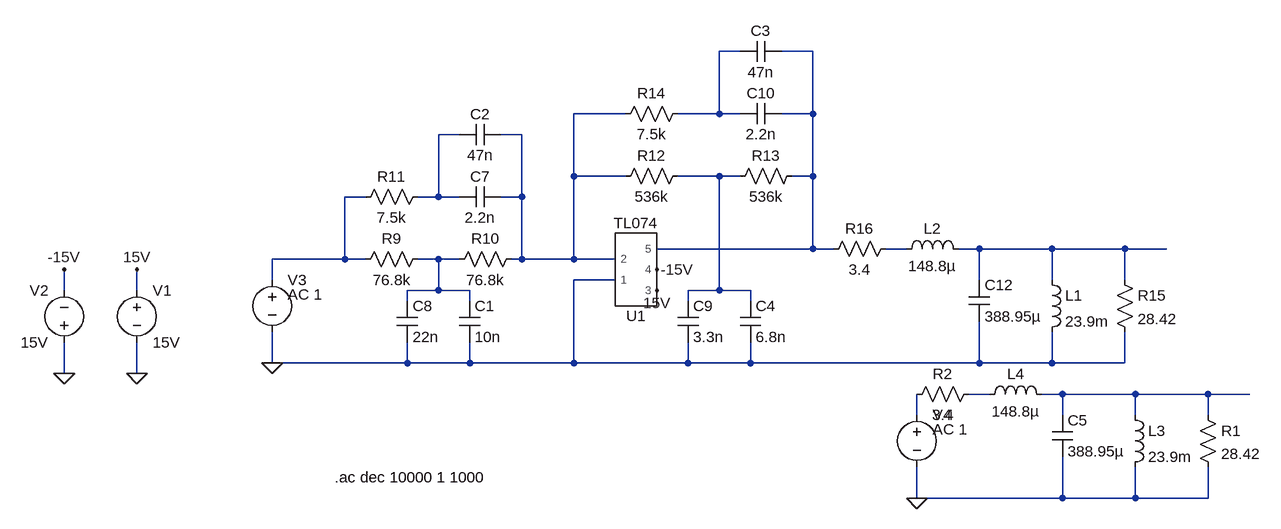
[diagram p0: schematic unmounted_pyle_lt_tl074.asc]
unmounted_pyle_lt_tl074.asc, the LTspice schematic file:
Version 4
SHEET 1 880 996
WIRE -704 240 -736 240
WIRE -592 240 -640 240
WIRE -880 336 -960 336
WIRE -736 336 -736 240
WIRE -736 336 -800 336
WIRE -704 336 -736 336
WIRE -592 336 -592 240
WIRE -592 336 -640 336
WIRE -1136 368 -1168 368
WIRE -1040 368 -1072 368
WIRE -960 432 -960 336
WIRE -880 432 -960 432
WIRE -736 432 -800 432
WIRE -704 432 -736 432
WIRE -592 432 -592 336
WIRE -592 432 -624 432
WIRE -1280 464 -1312 464
WIRE -1168 464 -1168 368
WIRE -1168 464 -1200 464
WIRE -1136 464 -1168 464
WIRE -1040 464 -1040 368
WIRE -1040 464 -1072 464
WIRE -592 544 -592 432
WIRE -592 544 -832 544
WIRE -560 544 -592 544
WIRE -448 544 -480 544
WIRE -336 544 -368 544
WIRE -224 544 -336 544
WIRE -112 544 -224 544
WIRE -48 544 -112 544
WIRE -1312 560 -1312 464
WIRE -1312 560 -1424 560
WIRE -1280 560 -1312 560
WIRE -1168 560 -1200 560
WIRE -1136 560 -1168 560
WIRE -1040 560 -1040 464
WIRE -1040 560 -1056 560
WIRE -960 560 -960 432
WIRE -960 560 -1040 560
WIRE -896 560 -960 560
WIRE -1424 592 -1424 560
WIRE -896 592 -960 592
WIRE -336 592 -336 544
WIRE -224 592 -224 544
WIRE -112 592 -112 544
WIRE -1744 608 -1744 576
WIRE -1632 608 -1632 576
WIRE -1168 608 -1168 560
WIRE -1168 608 -1216 608
WIRE -1120 608 -1168 608
WIRE -736 608 -736 432
WIRE -736 608 -784 608
WIRE -688 608 -736 608
WIRE -1216 624 -1216 608
WIRE -1120 624 -1120 608
WIRE -784 624 -784 608
WIRE -688 624 -688 608
WIRE -1424 720 -1424 672
WIRE -1216 720 -1216 688
WIRE -1216 720 -1424 720
WIRE -1120 720 -1120 688
WIRE -1120 720 -1216 720
WIRE -960 720 -960 592
WIRE -960 720 -1120 720
WIRE -784 720 -784 688
WIRE -784 720 -960 720
WIRE -688 720 -688 688
WIRE -688 720 -784 720
WIRE -336 720 -336 656
WIRE -336 720 -688 720
WIRE -224 720 -224 672
WIRE -224 720 -336 720
WIRE -112 720 -112 672
WIRE -112 720 -224 720
WIRE -1744 736 -1744 688
WIRE -1632 736 -1632 688
WIRE -320 768 -352 768
WIRE -208 768 -240 768
WIRE -96 768 -208 768
WIRE 16 768 -96 768
WIRE 80 768 16 768
WIRE -432 800 -432 768
WIRE -208 800 -208 768
WIRE -96 800 -96 768
WIRE 16 800 16 768
WIRE -432 928 -432 880
WIRE -208 928 -208 864
WIRE -208 928 -432 928
WIRE -96 928 -96 880
WIRE -96 928 -208 928
WIRE 16 928 16 880
WIRE 16 928 -96 928
FLAG -1424 720 0
FLAG -1632 576 15V
FLAG -1744 576 -15V
FLAG -1744 736 0
FLAG -1632 736 0
FLAG -832 608 15V
FLAG -432 928 0
FLAG -832 576 -15V
SYMBOL res -1184 544 R90
WINDOW 0 0 56 VBottom 2
WINDOW 3 32 56 VTop 2
SYMATTR InstName R9
SYMATTR Value 76.8k
SYMBOL res -1040 544 R90
WINDOW 0 0 56 VBottom 2
WINDOW 3 32 56 VTop 2
SYMATTR InstName R10
SYMATTR Value 76.8k
SYMBOL res -1184 448 R90
WINDOW 0 0 56 VBottom 2
WINDOW 3 32 56 VTop 2
SYMATTR InstName R11
SYMATTR Value 7.5k
SYMBOL cap -1072 448 R90
WINDOW 0 0 32 VBottom 2
WINDOW 3 32 32 VTop 2
SYMATTR InstName C7
SYMATTR Value 2.2n
SYMBOL cap -1232 624 R0
SYMATTR InstName C8
SYMATTR Value 22n
SYMBOL res -784 416 R90
WINDOW 0 0 56 VBottom 2
WINDOW 3 32 56 VTop 2
SYMATTR InstName R12
SYMATTR Value 536k
SYMBOL cap -800 624 R0
SYMATTR InstName C9
SYMATTR Value 3.3n
SYMBOL res -608 416 R90
WINDOW 0 0 56 VBottom 2
WINDOW 3 32 56 VTop 2
SYMATTR InstName R13
SYMATTR Value 536k
SYMBOL res -784 320 R90
WINDOW 0 0 56 VBottom 2
WINDOW 3 32 56 VTop 2
SYMATTR InstName R14
SYMATTR Value 7.5k
SYMBOL cap -640 320 R90
WINDOW 0 0 32 VBottom 2
WINDOW 3 32 32 VTop 2
SYMATTR InstName C10
SYMATTR Value 2.2n
SYMBOL cap -352 592 R0
SYMATTR InstName C12
SYMATTR Value 388.95µ
SYMBOL ind -240 576 R0
SYMATTR InstName L1
SYMATTR Value 23.9m
SYMBOL res -128 576 R0
SYMATTR InstName R15
SYMATTR Value 28.42
SYMBOL res -464 528 R90
WINDOW 0 0 56 VBottom 2
WINDOW 3 32 56 VTop 2
SYMATTR InstName R16
SYMATTR Value 3.4
SYMBOL voltage -1424 576 R0
WINDOW 123 24 38 Left 2
WINDOW 39 0 0 Left 0
SYMATTR Value2 AC 1
SYMATTR InstName V3
SYMATTR Value ""
SYMBOL voltage -1632 592 R0
SYMATTR InstName V1
SYMATTR Value 15V
SYMBOL voltage -1744 704 R180
WINDOW 0 24 96 Left 2
WINDOW 3 24 16 Left 2
SYMATTR InstName V2
SYMATTR Value 15V
SYMBOL cap -1136 624 R0
SYMATTR InstName C1
SYMATTR Value 10n
SYMBOL cap -1072 352 R90
WINDOW 0 0 32 VBottom 2
WINDOW 3 32 32 VTop 2
SYMATTR InstName C2
SYMATTR Value 47n
SYMBOL cap -640 224 R90
WINDOW 0 0 32 VBottom 2
WINDOW 3 32 32 VTop 2
SYMATTR InstName C3
SYMATTR Value 47n
SYMBOL cap -704 624 R0
SYMATTR InstName C4
SYMATTR Value 6.8n
SYMBOL ind -464 560 R270
WINDOW 0 32 56 VTop 2
WINDOW 3 5 56 VBottom 2
SYMATTR InstName L2
SYMATTR Value 148.8µ
SYMBOL cap -224 800 R0
SYMATTR InstName C5
SYMATTR Value 388.95µ
SYMBOL ind -112 784 R0
SYMATTR InstName L3
SYMATTR Value 23.9m
SYMBOL res 0 784 R0
SYMATTR InstName R1
SYMATTR Value 28.42
SYMBOL res -336 752 R90
WINDOW 0 0 56 VBottom 2
WINDOW 3 32 56 VTop 2
SYMATTR InstName R2
SYMATTR Value 3.4
SYMBOL ind -336 784 R270
WINDOW 0 32 56 VTop 2
WINDOW 3 5 56 VBottom 2
SYMATTR InstName L4
SYMATTR Value 148.8µ
SYMBOL voltage -432 784 R0
WINDOW 123 24 38 Left 2
WINDOW 39 0 0 Left 0
SYMATTR Value2 AC 1
SYMATTR InstName V4
SYMATTR Value ""
SYMBOL AutoGenerated/TL074 -864 576 M180
SYMATTR InstName U1
TEXT -1328 896 Left 2 !.ac dec 10000 1 1000

The netlist it stands for:
* unmounted_pyle_lt_tl074.asc
R9 N009 N006 76.8k
R10 N003 N009 76.8k
R11 N004 N006 7.5k
C7 N003 N004 2.2n
C8 N009 0 22n
R12 N005 N003 536k
C9 N005 0 3.3n
R13 N002 N005 536k
R14 N001 N003 7.5k
C10 N002 N001 2.2n
C12 N008 0 388.95µ
L1 N008 0 23.9m
R15 N008 0 28.42
R16 N007 N002 3.4
V3 N006 0 AC 1
V1 15V 0 15V
V2 0 -15V 15V
C1 N009 0 10n
C2 N003 N004 47n
C3 N002 N001 47n
C4 N005 0 6.8n
L2 N007 N008 148.8µ
C5 N011 0 388.95µ
L3 N011 0 23.9m
R1 N011 0 28.42
R2 N010 N012 3.4
L4 N010 N011 148.8µ
V4 N012 0 AC 1
XU1 0 N003 15V -15V N002 TL074  ; pins 1 2 3 4 5
.ac dec 10000 1 1000
.lib /Users/sujit/Documents/UNIVERSITY/3rd Year Project/git/3rd-year-project/OpenLoopDesign/Simulations/LTspice/PylePLPW6D/Datasheet/TL074.301
.backanno
.end